# Altium schematic sheet Motor_control.SchDoc
size A
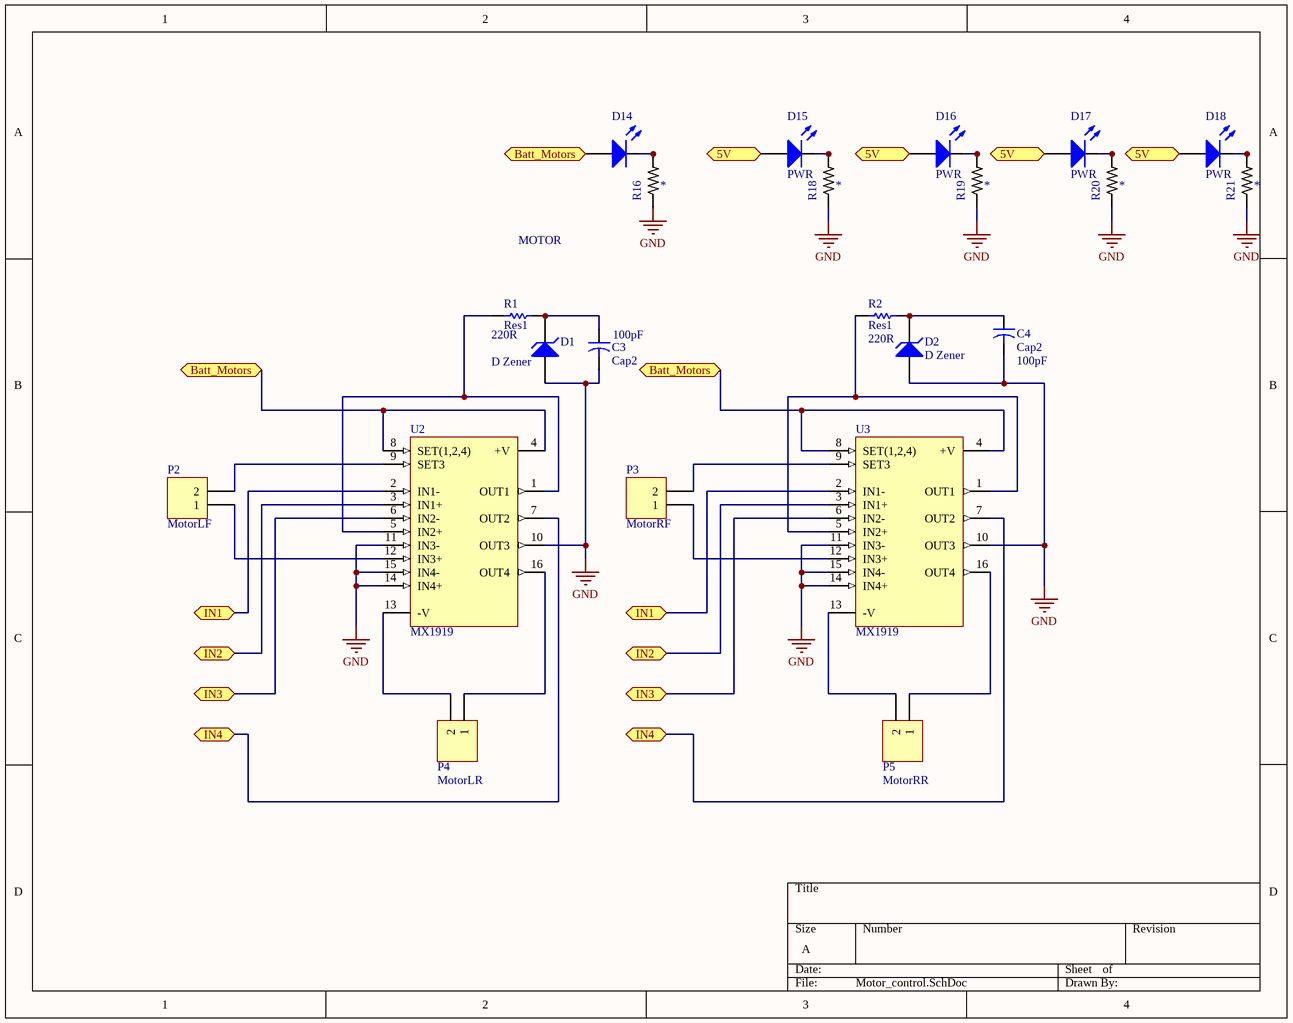
[diagram p0: Motor_control.SchDoc]

## Parts
C3  Cap2  value 100pF  [CAPR5-4X5]
C4  Cap2  value 100pF  [CAPR5-4X5]
D1  D Zener  [DIODE-0.7]
D2  D Zener  [DIODE-0.7]
D14  MOTOR  [3.2X1.6X1.1]
D15  PWR  [3.2X1.6X1.1]
D16  PWR  [3.2X1.6X1.1]
D17  PWR  [3.2X1.6X1.1]
D18  PWR  [3.2X1.6X1.1]
P2  MotorLF  [Micro_Metal_Motor]
P3  MotorRF  [Micro_Metal_Motor]
P4  MotorLR  [Micro_Metal_Motor]
P5  MotorRR  [Micro_Metal_Motor]
R1  Res1  value 220R  [AXIAL-0.3]
R2  Res1  value 220R  [AXIAL-0.3]
R16  Res_0805  [Res_0805]  (value not drawn)
R18  Res_0805  [Res_0805]  (value not drawn)
R19  Res_0805  [Res_0805]  (value not drawn)
R20  Res_0805  [Res_0805]  (value not drawn)
R21  Res_0805  [Res_0805]  (value not drawn)
U2  MX1919  [DIP16]
U3  MX1919  [DIP16]

## Ports
5V, Batt_Motors, IN1, IN2, IN3, IN4

## Nets
GND: C3.2 C4.2 D1.1(A) D2.1(A) R16.1 R18.1 R19.1 R20.1 R21.1 U2.10(OUT3) U2.11(IN3-) U2.14(IN4+) U2.15(IN4-) U3.10(OUT3) U3.11(IN3-) U3.14(IN4+) U3.15(IN4-)
5V: D15.1(A) D16.1(A) D17.1(A) D18.1(A) ; port 5V
Batt_Motors: D14.1(A) U2.4(+V) U2.8(SET(1,2,4)) U3.4(+V) U3.8(SET(1,2,4)) ; port Batt_Motors
IN1: U2.2(IN1-) U3.2(IN1-) ; port IN1
IN2: U2.3(IN1+) U3.3(IN1+) ; port IN2
IN3: U2.6(IN2-) U3.6(IN2-) ; port IN3
IN4: U2.7(OUT2) U3.7(OUT2) ; port IN4
NetC3_1: C3.1 D1.2(K) R1.1
NetC4_1: C4.1 D2.2(K) R2.1
NetD14_2: D14.2(K) R16.2
NetD15_2: D15.2(K) R18.2
NetD16_2: D16.2(K) R19.2
NetD17_2: D17.2(K) R20.2
NetD18_2: D18.2(K) R21.2
NetP2_1: P2.1 U2.12(IN3+)
NetP2_2: P2.2 U2.9(SET3)
NetP3_1: P3.1 U3.12(IN3+)
NetP3_2: P3.2 U3.9(SET3)
NetP4_1: P4.1 U2.16(OUT4)
NetP4_2: P4.2 U2.13(-V)
NetP5_1: P5.1 U3.16(OUT4)
NetP5_2: P5.2 U3.13(-V)
NetR1_2: R1.2 U2.1(OUT1) U2.5(IN2+)
NetR2_2: R2.2 U3.1(OUT1) U3.5(IN2+)

## Library data of the parts
C3 C4 = Cap2: Capacitor; Published: 23-Sep-2002; PackageReference: CAPR5-4X5; Publisher: Altium Limited; PackageDescription: Capacitor; 2 Leads
D1 D2 = D Zener: Zener Diode; Published: 8-Jun-2000; LatestRevisionDate: 17-Jul-2002; LatestRevisionNote: Re-released for DXP Platform.; PackageReference: DIODE-0.7; Publisher: Altium Limited; PackageDescription: Diode, Thru-Hole; 2 Leads; 0.7 in Pin Spacing
D14-D18 = LED2: Typical RED, GREEN, YELLOW, AMBER GaAs LED; Published: 8-Jun-2000; LatestRevisionDate: 17-Jul-2002; LatestRevisionNote: Re-released for DXP Platform.; PackageVersion: Feb-2002; PackageReference: 3.2X1.6X1.1; Publisher: Altium Limited; PackageDescription: SM LED; 2 Flat Leads
P2-P5 = Header 2: Header, 2-Pin; LatestRevisionDate: 17-Jul-2002; LatestRevisionNote: Re-released for DXP Platform.; Publisher: Altium Limited
R1 R2 = Res1: Resistor; Published: 8-Jun-2000; LatestRevisionDate: 17-Jul-2002; LatestRevisionNote: Re-released for DXP Platform.; PackageReference: AXIAL-0.3; Publisher: Altium Limited; PackageDescription: Axial Device, Thru-Hole; 2 Leads; 0.3 in Pin Spacing
R16 R18-R21 = Res_0805: Res Thick Film 0805 392 Ohm 1% 1/3W Â±100ppm/Â°C Molded SMD SMD T/R; MP: CRGH0805F392R; MF: TE Connectivity; TE_purchase_URL: https://www.te.com/usa-en/product-5-1879509-5.html?te_bu=Cor&te_type=disp&te_campaign=seda_glo_cor-seda-global-disp-prtnr-fy19-seda-model-bom-cta_sma-317_1&elqCampaignId=32493; Availability: Unavailable; SnapEDA_Link: https://www.snapeda.com/parts/CRGH0805F392R/TE%20Connectivity%20Passive%20Product/view-part/?ref=snap; Price: None; Package: 0805 TE Connectivity; Value: *
U2 U3 = LM246N: Programmable Quad Bipolar Operational Amplifier; Published: 24-Aug-2001; LatestRevisionDate: 06-Jun-2005; LatestRevisionNote: Stylized 3D Model Added.; DatasheetVersion: Nov-1997; PackageVersion: Apr-1996; PackageReference: DIP16; Publisher: Altium Limited; PackageDescription: DIP; 16 Leads; Row Spacing 7.62 mm; Pitch 2.54 mm; ComponentLink1Description: Manufacturer Link; ComponentLink1URL: http://www.st.com/; ComponentLink2Description: Datasheet; ComponentLink2URL: http://www.st.com/stonline/products/literature/ds/2160/lm346.pdf